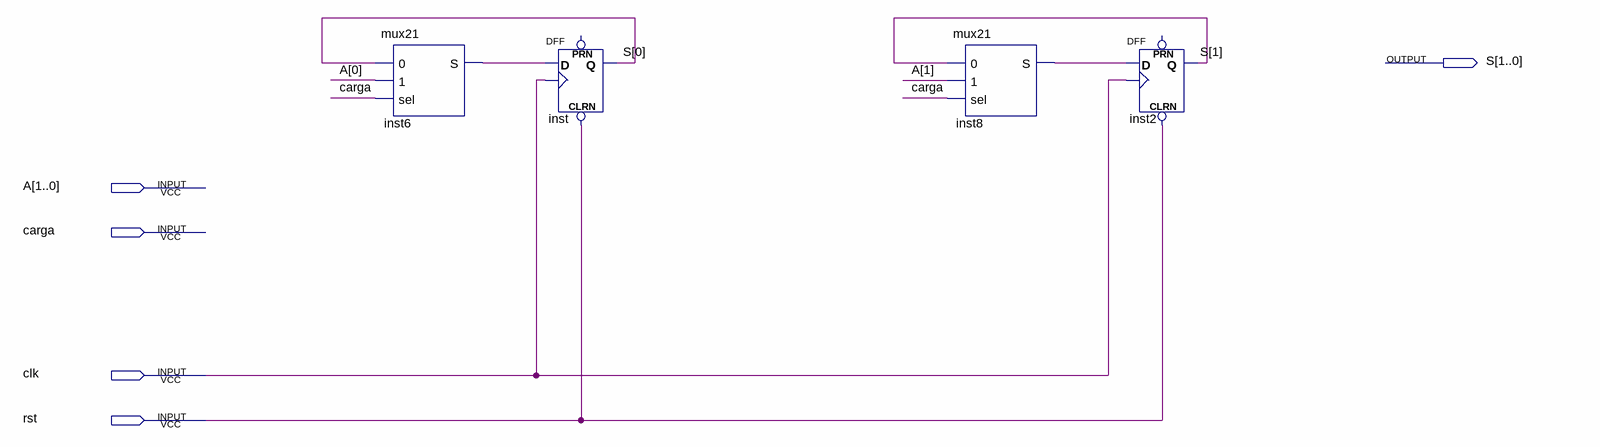
[diagram p0: schematic sheet]
// Quartus schematic reg.bdf as structural Verilog: 4 symbols, 5 pins
module \reg  (
  input  [1:0] A,
  input  carga,
  input  clk,
  input  rst,
  output [1:0] S
);

  wire inst6_s, inst8_s;

  mux21 inst6 (.\0 (S[0]), .\1 (A[0]), .sel(carga), .S(inst6_s));
  DFF inst (.CLRN(rst), .CLK(clk), .D(inst6_s), .Q(S[0]));  // open: PRN
  mux21 inst8 (.\0 (S[1]), .\1 (A[1]), .sel(carga), .S(inst8_s));
  DFF inst2 (.CLRN(rst), .CLK(clk), .D(inst8_s), .Q(S[1]));  // open: PRN
endmodule
